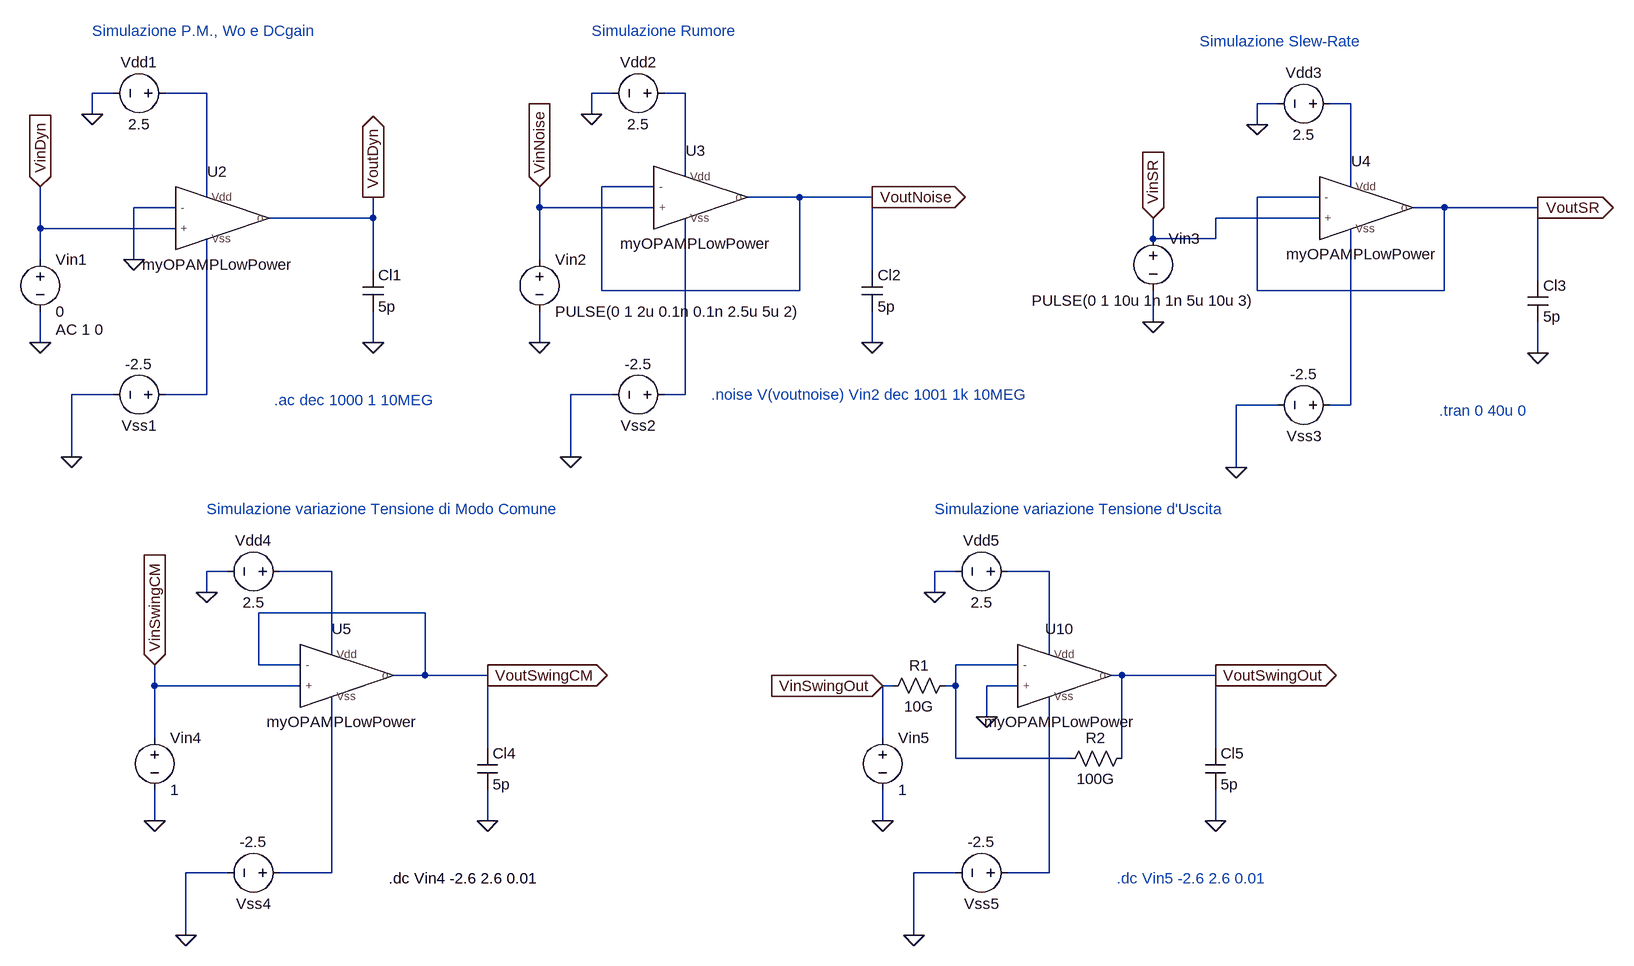
[diagram p0: schematic OperationalAmplifierLowPower.asc]
OperationalAmplifierLowPower.asc, the LTspice schematic file:
Version 4
SHEET 1 1712 932
WIRE -928 -448 -960 -448
WIRE -784 -448 -848 -448
WIRE -160 -448 -192 -448
WIRE -48 -448 -80 -448
WIRE 864 -432 832 -432
WIRE 976 -432 944 -432
WIRE -960 -416 -960 -448
WIRE -192 -416 -192 -448
WIRE 832 -400 832 -432
WIRE -48 -320 -48 -448
WIRE -96 -304 -176 -304
WIRE 976 -304 976 -432
WIRE -784 -288 -784 -448
WIRE 128 -288 48 -288
WIRE 240 -288 128 -288
WIRE 928 -288 832 -288
WIRE -832 -272 -896 -272
WIRE -272 -272 -272 -304
WIRE -96 -272 -272 -272
WIRE 1120 -272 1072 -272
WIRE 1264 -272 1120 -272
WIRE -528 -256 -528 -288
WIRE -528 -256 -688 -256
WIRE 928 -256 768 -256
WIRE -1040 -240 -1040 -304
WIRE -832 -240 -1040 -240
WIRE 672 -224 672 -256
WIRE 768 -224 768 -256
WIRE 768 -224 672 -224
WIRE -1040 -192 -1040 -240
WIRE -896 -192 -896 -272
WIRE -272 -192 -272 -272
WIRE -528 -176 -528 -256
WIRE 240 -176 240 -288
WIRE 1264 -160 1264 -272
WIRE -176 -144 -176 -304
WIRE 128 -144 128 -288
WIRE 128 -144 -176 -144
WIRE 832 -144 832 -288
WIRE 1120 -144 1120 -272
WIRE 1120 -144 832 -144
WIRE 672 -96 672 -144
WIRE -1040 -64 -1040 -112
WIRE -528 -64 -528 -112
WIRE -272 -64 -272 -112
WIRE 240 -64 240 -112
WIRE 1264 -48 1264 -96
WIRE -928 16 -992 16
WIRE -784 16 -784 -224
WIRE -784 16 -848 16
WIRE -160 16 -224 16
WIRE -48 16 -48 -256
WIRE -48 16 -80 16
WIRE 864 32 800 32
WIRE 976 32 976 -240
WIRE 976 32 944 32
WIRE -992 112 -992 16
WIRE -224 112 -224 16
WIRE 800 128 800 32
WIRE -752 288 -784 288
WIRE -592 288 -672 288
WIRE 368 288 336 288
WIRE 512 288 448 288
WIRE -784 320 -784 288
WIRE 336 320 336 288
WIRE -448 352 -704 352
WIRE -592 416 -592 288
WIRE 512 416 512 288
WIRE -704 432 -704 352
WIRE -640 432 -704 432
WIRE 464 432 368 432
WIRE -448 448 -448 352
WIRE -448 448 -496 448
WIRE -352 448 -448 448
WIRE 624 448 608 448
WIRE 768 448 624 448
WIRE -864 464 -864 432
WIRE -640 464 -864 464
WIRE 272 464 256 464
WIRE 368 464 368 432
WIRE 368 464 352 464
WIRE 464 464 416 464
WIRE 416 512 416 464
WIRE -864 544 -864 464
WIRE 256 544 256 464
WIRE -352 560 -352 448
WIRE 768 560 768 448
WIRE 368 576 368 464
WIRE 544 576 368 576
WIRE 624 576 624 448
WIRE -864 672 -864 624
WIRE -352 672 -352 624
WIRE 256 672 256 624
WIRE 768 672 768 624
WIRE -752 752 -816 752
WIRE -592 752 -592 480
WIRE -592 752 -672 752
WIRE 368 752 304 752
WIRE 512 752 512 480
WIRE 512 752 448 752
WIRE -816 848 -816 752
WIRE 304 848 304 752
FLAG -528 -64 0
FLAG -1040 -64 0
FLAG -960 -416 0
FLAG -992 112 0
FLAG -1040 -304 VinDyn
IOPIN -1040 -304 In
FLAG -528 -288 VoutDyn
IOPIN -528 -288 Out
FLAG -896 -192 0
FLAG 240 -64 0
FLAG -272 -64 0
FLAG -192 -416 0
FLAG -224 112 0
FLAG -272 -304 VinNoise
IOPIN -272 -304 In
FLAG 240 -288 VoutNoise
IOPIN 240 -288 Out
FLAG 1264 -48 0
FLAG 672 -96 0
FLAG 832 -400 0
FLAG 800 128 0
FLAG 672 -256 VinSR
IOPIN 672 -256 In
FLAG 1264 -272 VoutSR
IOPIN 1264 -272 Out
FLAG -352 672 0
FLAG -864 672 0
FLAG -784 320 0
FLAG -816 848 0
FLAG -864 432 VinSwingCM
IOPIN -864 432 In
FLAG -352 448 VoutSwingCM
IOPIN -352 448 Out
FLAG 768 672 0
FLAG 256 672 0
FLAG 336 320 0
FLAG 304 848 0
FLAG 256 464 VinSwingOut
IOPIN 256 464 In
FLAG 768 448 VoutSwingOut
IOPIN 768 448 Out
FLAG 416 512 0
SYMBOL cap -544 -176 R0
SYMATTR InstName Cl1
SYMATTR Value 5p
SYMBOL voltage -1040 -208 R0
WINDOW 123 24 124 Left 2
WINDOW 39 0 0 Left 0
SYMATTR Value2 AC 1 0
SYMATTR InstName Vin1
SYMATTR Value 0
SYMBOL voltage -832 -448 R90
WINDOW 0 -32 56 VBottom 2
WINDOW 3 32 56 VTop 2
SYMATTR InstName Vdd1
SYMATTR Value 2.5
SYMBOL voltage -832 16 R90
WINDOW 0 32 56 VTop 2
WINDOW 3 -32 56 VBottom 2
WINDOW 123 0 0 Left 0
WINDOW 39 0 0 Left 0
SYMATTR InstName Vss1
SYMATTR Value -2.5
SYMBOL cap 224 -176 R0
SYMATTR InstName Cl2
SYMATTR Value 5p
SYMBOL voltage -272 -208 R0
WINDOW 123 24 124 Left 2
WINDOW 39 0 0 Left 0
SYMATTR InstName Vin2
SYMATTR Value PULSE(0 1 2u 0.1n 0.1n 2.5u 5u 2)
SYMBOL voltage -64 -448 R90
WINDOW 0 -32 56 VBottom 2
WINDOW 3 32 56 VTop 2
SYMATTR InstName Vdd2
SYMATTR Value 2.5
SYMBOL voltage -64 16 R90
WINDOW 0 32 56 VTop 2
WINDOW 3 -32 56 VBottom 2
WINDOW 123 0 0 Left 0
WINDOW 39 0 0 Left 0
SYMATTR InstName Vss2
SYMATTR Value -2.5
SYMBOL cap 1248 -160 R0
SYMATTR InstName Cl3
SYMATTR Value 5p
SYMBOL voltage 672 -240 R0
WINDOW 123 0 0 Left 0
WINDOW 39 0 0 Left 0
WINDOW 3 -187 111 Left 2
SYMATTR Value PULSE(0 1 10u 1n 1n 5u 10u 3)
SYMATTR InstName Vin3
SYMBOL voltage 960 -432 R90
WINDOW 0 -32 56 VBottom 2
WINDOW 3 32 56 VTop 2
SYMATTR InstName Vdd3
SYMATTR Value 2.5
SYMBOL voltage 960 32 R90
WINDOW 0 32 56 VTop 2
WINDOW 3 -32 56 VBottom 2
WINDOW 123 0 0 Left 0
WINDOW 39 0 0 Left 0
SYMATTR InstName Vss3
SYMATTR Value -2.5
SYMBOL cap -368 560 R0
SYMATTR InstName Cl4
SYMATTR Value 5p
SYMBOL voltage -864 528 R0
WINDOW 123 0 0 Left 0
WINDOW 39 0 0 Left 0
SYMATTR InstName Vin4
SYMATTR Value 1
SYMBOL voltage -656 288 R90
WINDOW 0 -32 56 VBottom 2
WINDOW 3 32 56 VTop 2
SYMATTR InstName Vdd4
SYMATTR Value 2.5
SYMBOL voltage -656 752 R90
WINDOW 0 32 56 VTop 2
WINDOW 3 -32 56 VBottom 2
WINDOW 123 0 0 Left 0
WINDOW 39 0 0 Left 0
SYMATTR InstName Vss4
SYMATTR Value -2.5
SYMBOL cap 752 560 R0
SYMATTR InstName Cl5
SYMATTR Value 5p
SYMBOL voltage 256 528 R0
WINDOW 123 0 0 Left 0
WINDOW 39 0 0 Left 0
SYMATTR InstName Vin5
SYMATTR Value 1
SYMBOL voltage 464 288 R90
WINDOW 0 -32 56 VBottom 2
WINDOW 3 32 56 VTop 2
SYMATTR InstName Vdd5
SYMATTR Value 2.5
SYMBOL voltage 464 752 R90
WINDOW 0 32 56 VTop 2
WINDOW 3 -32 56 VBottom 2
WINDOW 123 0 0 Left 0
WINDOW 39 0 0 Left 0
SYMATTR InstName Vss5
SYMATTR Value -2.5
SYMBOL res 368 448 R90
WINDOW 0 0 56 VBottom 2
WINDOW 3 32 56 VTop 2
SYMATTR InstName R1
SYMATTR Value 10G
SYMBOL res 640 560 R90
WINDOW 0 0 56 VBottom 2
WINDOW 3 32 56 VTop 2
SYMATTR InstName R2
SYMATTR Value 100G
SYMBOL AutoGenerated\\myOPAMPLowPower -768 -256 R0
SYMATTR InstName U2
SYMBOL AutoGenerated\\myOPAMPLowPower -32 -288 R0
SYMATTR InstName U3
SYMBOL AutoGenerated\\myOPAMPLowPower 992 -272 R0
SYMATTR InstName U4
SYMBOL AutoGenerated\\myOPAMPLowPower -576 448 R0
SYMATTR InstName U5
SYMBOL AutoGenerated\\myOPAMPLowPower 528 448 R0
SYMATTR InstName U10
TEXT -960 -544 Left 2 ;Simulazione P.M., Wo e DCgain
TEXT -680 24 Left 2 ;.ac dec 1000 1 10MEG
TEXT -192 -544 Left 2 ;Simulazione Rumore
TEXT -8 16 Left 2 ;.noise V(voutnoise) Vin2 dec 1001 1k 10MEG
TEXT 744 -528 Left 2 ;Simulazione Slew-Rate
TEXT 1112 40 Left 2 ;.tran 0 40u 0
TEXT -784 192 Left 2 ;Simulazione variazione Tensione di Modo Comune
TEXT -504 760 Left 2 !.dc Vin4 -2.6 2.6 0.01
TEXT 336 192 Left 2 ;Simulazione variazione Tensione d'Uscita
TEXT 616 760 Left 2 ;.dc Vin5 -2.6 2.6 0.01

The netlist it stands for:
* OperationalAmplifierLowPower.asc
Cl1 VoutDyn 0 5p
Vin1 VinDyn 0 0 AC 1 0
Vdd1 N001 0 2.5
Vss1 N004 0 -2.5
Cl2 VoutNoise 0 5p
Vin2 VinNoise 0 PULSE(0 1 2u 0.1n 0.1n 2.5u 5u 2)
Vdd2 N002 0 2.5
Vss2 N005 0 -2.5
Cl3 VoutSR 0 5p
Vin3 VinSR 0 PULSE(0 1 10u 1n 1n 5u 10u 3)
Vdd3 N003 0 2.5
Vss3 N006 0 -2.5
Cl4 VoutSwingCM 0 5p
Vin4 VinSwingCM 0 1
Vdd4 N007 0 2.5
Vss4 N010 0 -2.5
Cl5 VoutSwingOut 0 5p
Vin5 VinSwingOut 0 1
Vdd5 N008 0 2.5
Vss5 N011 0 -2.5
R1 N009 VinSwingOut 10G
R2 VoutSwingOut N009 100G
XU2 VinDyn 0 VoutDyn N001 N004 myOPAMPLowPower  ; pins + - o Vdd Vss
XU3 VinNoise VoutNoise VoutNoise N002 N005 myOPAMPLowPower  ; pins + - o Vdd Vss
XU4 VinSR VoutSR VoutSR N003 N006 myOPAMPLowPower  ; pins + - o Vdd Vss
XU5 VinSwingCM VoutSwingCM VoutSwingCM N007 N010 myOPAMPLowPower  ; pins + - o Vdd Vss
XU10 0 N009 VoutSwingOut N008 N011 myOPAMPLowPower  ; pins + - o Vdd Vss
* Simulazione P.M., Wo e DCgain
* .ac dec 1000 1 10MEG
* Simulazione Rumore
* .noise V(voutnoise) Vin2 dec 1001 1k 10MEG
* Simulazione Slew-Rate
* .tran 0 40u 0
* Simulazione variazione Tensione di Modo Comune
.dc Vin4 -2.6 2.6 0.01
* Simulazione variazione Tensione d'Uscita
* .dc Vin5 -2.6 2.6 0.01
.lib C:\Users\andre\Desktop\Universita\PrimoAnno\SecondoSemestre\ProgettiAnalogici\OpAmpProject\LowPower\OperationalAmplifierLowPower.cir
.backanno
.end